# Altium schematic sheet Filter.SchDoc
size A4; Author: Author Name; Organization: ORGANIZATION; Address1: ADDRESS 1; Address2: ADDRESS 2; Address3: ADDRESS 3; Address4: ADDRESS 4; Revision: -; SheetNumber: 3; SheetTotal: 6; ENG_APP_DATE: --/--/--; DSN_APP_DATE: --/--/--; CHK_APP_DATE: --/--/--
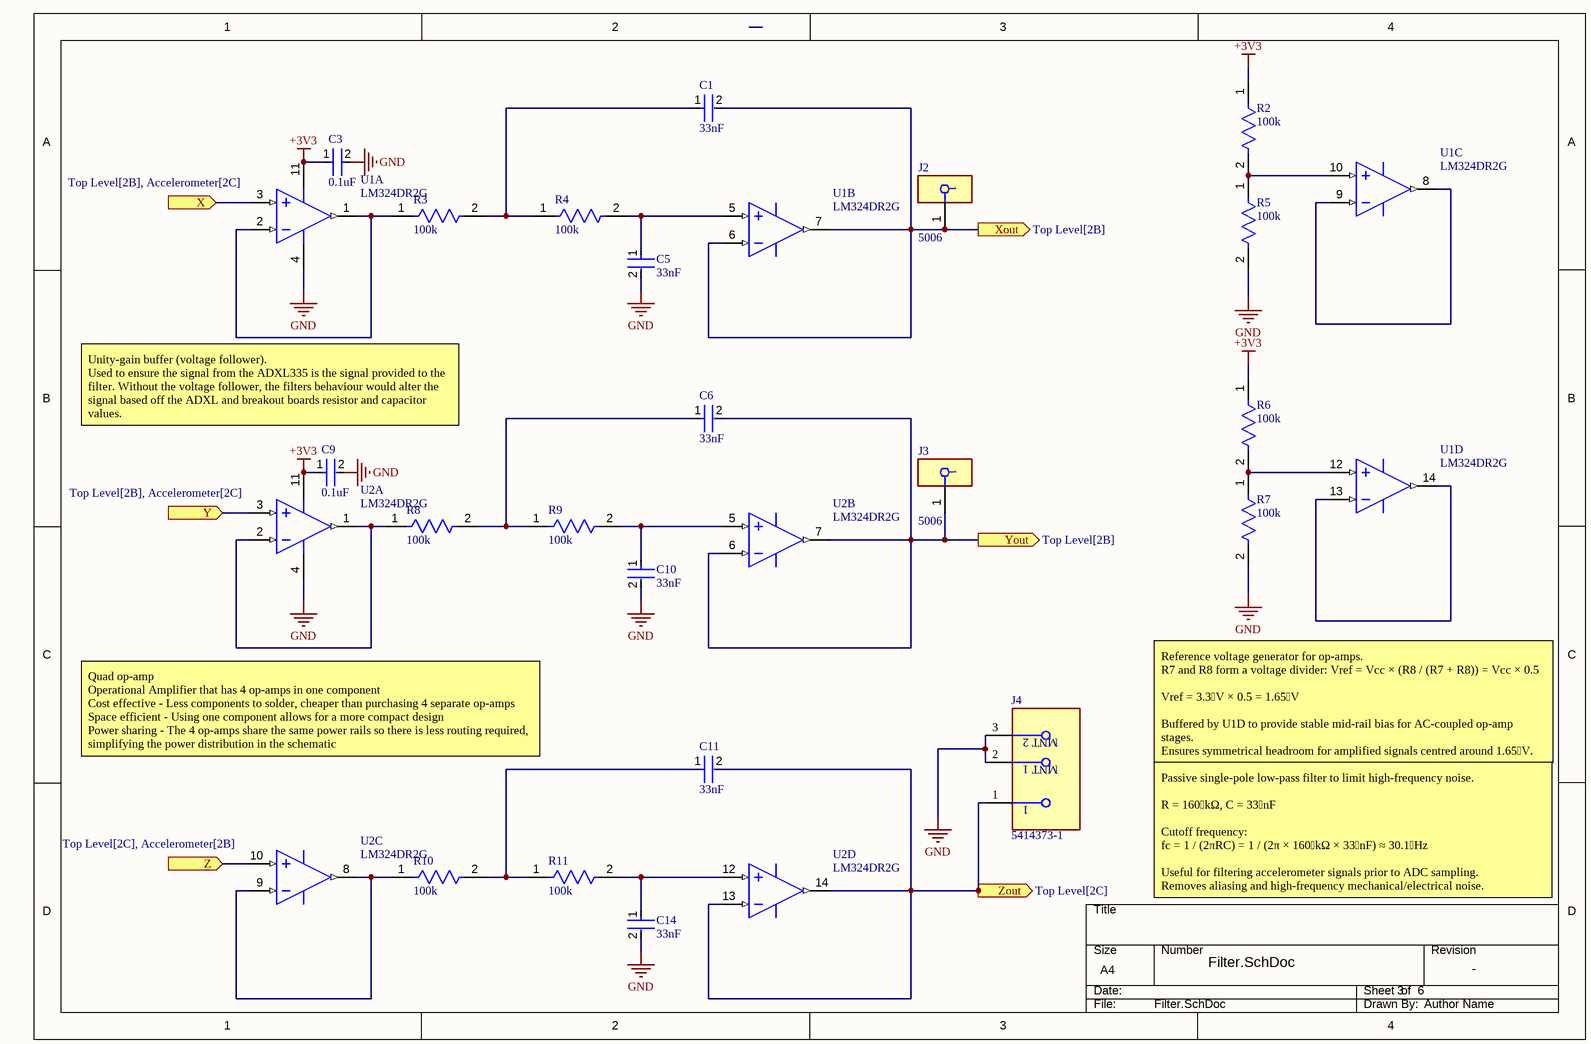
[diagram p0: Filter.SchDoc]

## Parts
C1  33nF  [FP-CC0805-0_85-MFG]
C3  0.1uF  [FP-C0805C-DN-MFG]
C5  33nF  [FP-CC0805-0_85-MFG]
C6  33nF  [FP-CC0805-0_85-MFG]
C9  0.1uF  [FP-C0805C-DN-MFG]
C10  33nF  [FP-CC0805-0_85-MFG]
C11  33nF  [FP-CC0805-0_85-MFG]
C14  33nF  [FP-CC0805-0_85-MFG]
J2  5006  [FP-5006-MFG]
J3  5006  [FP-5006-MFG]
J4  5414373-1  [FP-5414373-1-MFG]
R2  100k  [FP-RMCF0805-IPC_C]
R3  100k  [FP-RMCF0805-IPC_C]
R4  100k  [FP-RMCF0805-IPC_C]
R5  100k  [FP-RMCF0805-IPC_C]
R6  100k  [FP-RMCF0805-IPC_C]
R7  100k  [FP-RMCF0805-IPC_C]
R8  100k  [FP-RMCF0805-IPC_C]
R9  100k  [FP-RMCF0805-IPC_C]
R10  100k  [FP-RMCF0805-IPC_C]
R11  100k  [FP-RMCF0805-IPC_C]
U1  LM324DR2G  [ONSC-SOIC-14-751A-03_V]  (parts A,B,C,D of 4)
U2  LM324DR2G  [ONSC-SOIC-14-751A-03_V]  (parts A,B,C,D of 4)

## Ports
X (in, see Top Level[2B], Accelerometer[2C]), Xout (out, see Top Level[2B]), Y (in, see Top Level[2B], Accelerometer[2C]), Yout (out, see Top Level[2B]), Z (in, see Top Level[2C], Accelerometer[2B]), Zout (out, see Top Level[2C])

## Nets
+3V3: C3.1 C9.1 R2.1 R6.1 U1.11(VEE/GND) U2.11(VEE/GND)
GND: C3.2 C5.2 C9.2 C10.2 C14.2 J4.2(MNT_1) J4.3(MNT_2) R5.2 R7.2 U1.4(VCC) U2.4(VCC)
X: U1.3(IN1+) ; port X
Xout: C1.2 J2.1 U1.6(IN2-) U1.7(OUT2) ; port Xout
Y: U2.3(IN1+) ; port Y
Yout: C6.2 J3.1 U2.6(IN2-) U2.7(OUT2) ; port Yout
Z: U2.10(IN3+) ; port Z
Zout: C11.2 J4.1 U2.13(IN4-) U2.14(OUT4) ; port Zout
NetC1_1: C1.1 R3.2 R4.1
NetC5_1: C5.1 R4.2 U1.5(IN2+)
NetC6_1: C6.1 R8.2 R9.1
NetC10_1: C10.1 R9.2 U2.5(IN2+)
NetC11_1: C11.1 R10.2 R11.1
NetC14_1: C14.1 R11.2 U2.12(IN4+)
NetR2_2: R2.2 R5.1 U1.10(IN3+)
NetR3_1: R3.1 U1.1(OUT1) U1.2(IN1-)
NetR6_2: R6.2 R7.1 U1.12(IN4+)
NetR8_1: R8.1 U2.1(OUT1) U2.2(IN1-)
NetR10_1: R10.1 U2.8(OUT3) U2.9(IN3-)
NetU1_8: U1.8(OUT3) U1.9(IN3-)
NetU1_13: U1.13(IN4-) U1.14(OUT4)

## Notes on the sheet
- Unity-gain buffer (voltage follower).
  Used to ensure the signal from the ADXL335 is the signal provided to the filter. Without the voltage follower, the filters behaviour would alter the signal based off the ADXL and breakout boards resistor and capacitor values.
- Quad op-amp
  Operational Amplifier that has 4 op-amps in one component
  Cost effective - Less components to solder, cheaper than purchasing 4 separate op-amps
  Space efficient - Using one component allows for a more compact design
  Power sharing - The 4 op-amps share the same power rails so there is less routing required, simplifying the power distribution in the schematic
- Reference voltage generator for op-amps.
  R7 and R8 form a voltage divider: Vref = Vcc × (R8 / (R7 + R8)) = Vcc × 0.5
  Vref = 3.3 V × 0.5 = 1.65 V
  Buffered by U1D to provide stable mid-rail bias for AC-coupled op-amp stages.
  Ensures symmetrical headroom for amplified signals centred around 1.65 V.
- Passive single-pole low-pass filter to limit high-frequency noise.
  R = 160 kΩ, C = 33 nF
  Cutoff frequency:
  fc = 1 / (2πRC) = 1 / (2π × 160 kΩ × 33 nF) ≈ 30.1 Hz
  Useful for filtering accelerometer signals prior to ADC sampling.
  Removes aliasing and high-frequency mechanical/electrical noise.
- DWG. NO.
- REV.
- SHT.
- THIS DOCUMENT AND THE DATA DISCLOSED HEREIN OR HEREWITH IS THE PROPERTY OF ALTIUM LIMITED AND MAY BE FREELY DISTRIBUTED IN WHOLE. NO RIGHTS ARE RESERVED OR EXPRESS OR IMPLIED WARANTEE GIVEN.
- REVISION
- DESCRIPTION
- DATE
- APPROVED
- ENG:
- APPROVALS
- PROJECT
- DSN:
- CHK:
- REFERENCE DOCUMENTS
- PROJECT REVISION:
- TITLE
- DOCUMENT REVISION:
- DESIGN ITEM:
- BOM:
- FAB DWG:
- PCB DWG:
- ASSY DWG:
- SCALE:
- SIZE
- B
- CAGE CODE
- FILE NAME
- DWG NO.
- SHEET
- OF
- REV

## Library data of the parts
C1 C5 C6 C10 C11 C14 = CMP-03422-000099-1: CAP CER 0.033UF 50V X7R 0805, CC0805KRX7R9BB333; Manufacturer: Yageo; Material: Ceramic; Tolerance: 0.1; Ipc Land Pattern Name: CAPC200125X85; Mouser Description: Multilayer Ceramic Capacitors MLCC - SMD/SMT 33nF 50V X7R 10%; Value: 33 nF; Voltage Rating: 50 V; Temperature Characteristic: X7R; Temperature Range Low: -30°C; Temperature Range High: +85°C; Octopart: https://octopart.com/cc0805krx7r9bb333-yageo-42333931; Category: Cap; ComponentLink2URL: http://www.yageo.com/documents/recent/UPY-GPHC_Y5V_6.3V-to-50V_8.pdf; Device Class L1: Passive Components; Package: CC0805-0.85; Device Class L2: Capacitors; Footprint Url: http://www.yageo.com/exep/pages/download/literatures/UPY-C_GEN_24.pdf; Lead Free: Yes; Temperature: -30°C to +85°C; Manufacturer Part Number: CC0805KRX7R9BB333; Automotive: No; Height: 0.95mm; Digikey Description: CAP CER 0.033UF 50V X7R 0805; RoHS: TRUE; ComponentLink2Description: Datasheet; Capacitance: 33 nF; Device Class L3: Ceramic Capacitors
C3 C9 = CMP-03020-000950-1: CAP CER 0.1UF 50V X7R 0805; Manufacturer: KEMET; Manufacturer Part Number: C0805C104J5RACTU; Temperature Coefficient: 30ppm/°C; Value: 0.10 μF; Material: Ceramic; Tolerance: 0.05; Voltage Rating: 50 V; Digikey Description: CAP CER 0.1UF 50V X7R 0805; Octopart: https://octopart.com/c0805c104j5ractu-kemet-104634; RoHS: TRUE; Device Class L1: Passive Components; Temperature Characteristic: X7R; Device Class L3: Ceramic Capacitors; Lead Free: Yes; Automotive: No; Category: Cap; Temperature: -55°C to +125°C; Package: C0805C-DN; Temperature Range High: +125°C; Height: 0.88mm; Capacitance: 0.10 μF; Temperature Range Low: -55°C; ComponentLink2Description: Datasheet; ComponentLink2URL: https://content.kemet.com/datasheets/KEM_C1003_C0G_SMD.pdf; Ipc Land Pattern Name: CAPC200125X78; Device Class L2: Capacitors; Mouser Description: Multilayer Ceramic Capacitors MLCC - SMD/SMT 50volts 0.1uF X7R 5%
J2 J3 = CMP-19636-000022-1: PC TEST POINT COMPACT BLACK; Body Material: Bronze; Inside Diameter: 1.78mm; Number of Ports: 1; Hole Diameter: 1.6mm; Outside Diameter: 3.18mm; Plating: Silver; Contact Plating: Tin; Color: Black; RoHS Compliant: Yes; Flammability Rating: UL94 V-0; Contact Material: Bronze; Material: Nylon; Orientation: Straight; Package Quantity: 100; Housing Color: Black; Length: 8.89mm; Series: THM; Mount: PCB; Height: 0.35inch; Packaging: Bulk; REACH SVHC: No SVHC; Insulation Material: Nylon; Lead Free: Lead Free
J4 = CMP-03357-000008-1: CONN BNC JACK R/A 50 OHM PCB; Dielectric Material: Polymethylpentene; Body Material: Zinc; Gender: Female; PCB Mount Retention: Without; Body Plating: Nickel; Operating Frequency: 0 to 4 GHz; Wire/Cable Type: Coaxial; PCB Mounting Orientation: Right Angle; Sealable: No (Without); Frequency: 4GHz; Number of Positions: 1; Mating Cycles: 500; Insulation Resistance: 5GR; Voltage Rating: 500V; Impedance: 50R; Center Contact Plating: Gold; Polarity: Standard; Orientation: Right Angle; Housing Color: Silver; Min Operating Temperature: -55°C; Termination: Through Hole; Radiation Hardening: No; Packaging: Tray; Insulation Material: Polymethylpentene; Package Quantity: 50; Max Operating Temperature: 85°C; Mount: Through Hole; Fastening Type: Bayonet; Number of Ports: 1; Connector Type: BNC; Contact Plating: Gold; Series: -; Max Frequency: 4GHz; Contact Material: Bronze; Length: 25.4mm
R2-R11 = CMP-26527-003818-1: 100kΩ ±1% 0.125W 0805 Thick Film Chip Resistor AEC-Q200 compliant, RMCF0805FG100K; Temperature Coefficient: 100ppm/°C; Max Power Dissipation: 125mW; Resistance: 100kR; Case Code (Metric): 2012; Width: 0.049inch; Min Operating Temperature: -55°C; Features: Automotive AEC-Q200; Contact Plating: Tin; Radiation Hardening: No; Construction: Rectangular; RoHS Compliant: Yes; Package Quantity: 10000; Resistor Type: Thick Film; Military Standard: Not; Series: RMCF; Number of Terminations: 2; Height: 0.026inch; Max Operating Temperature: 155°C; Case/Package: 0805; Case Code (Imperial): 0805; Tolerance: 1%; Packaging: Tape and Reel; Depth: 1.25mm; Mount: Surface Mount; Length: 0.079inch
U1 U2 = CMP-1310-00171-1: Single Supply Quad Operational Amplifier, 3 to 32 V, 0 to 70 degC, 14-Pin SOIC, Pb-Free, Tape and Reel; Manufacturer: On Semiconductor; VCC Max (V): 32; VCC Min (V): 3; PackageVersion: Rev. K, 05/2011; ComponentLink3URL: http://www.onsemi.com/pub_link/Collateral/751A-03.PDF; ComponentLink3Description: Package Specification; Packing: Tape and Reel; ComponentLink2URL: http://www.onsemi.cn/pub_link/Collateral/LM324-D.PDF; PackageReference: SOIC-14-751A-03; ComponentLink1URL: http://www.onsemi.com/; PackageDescription: 14-Pin Small Outline Integrated Circuit, Body 8.65 x 3.9 mm, Pitch 1.27 mm; ComponentLink1Description: Manufacturer URL; DatasheetVersion: Rev. 25; Mounting Technology: Surface Mount; RoHS: TRUE; ComponentLink2Description: Datasheet; PartNumber: LM324DR2G